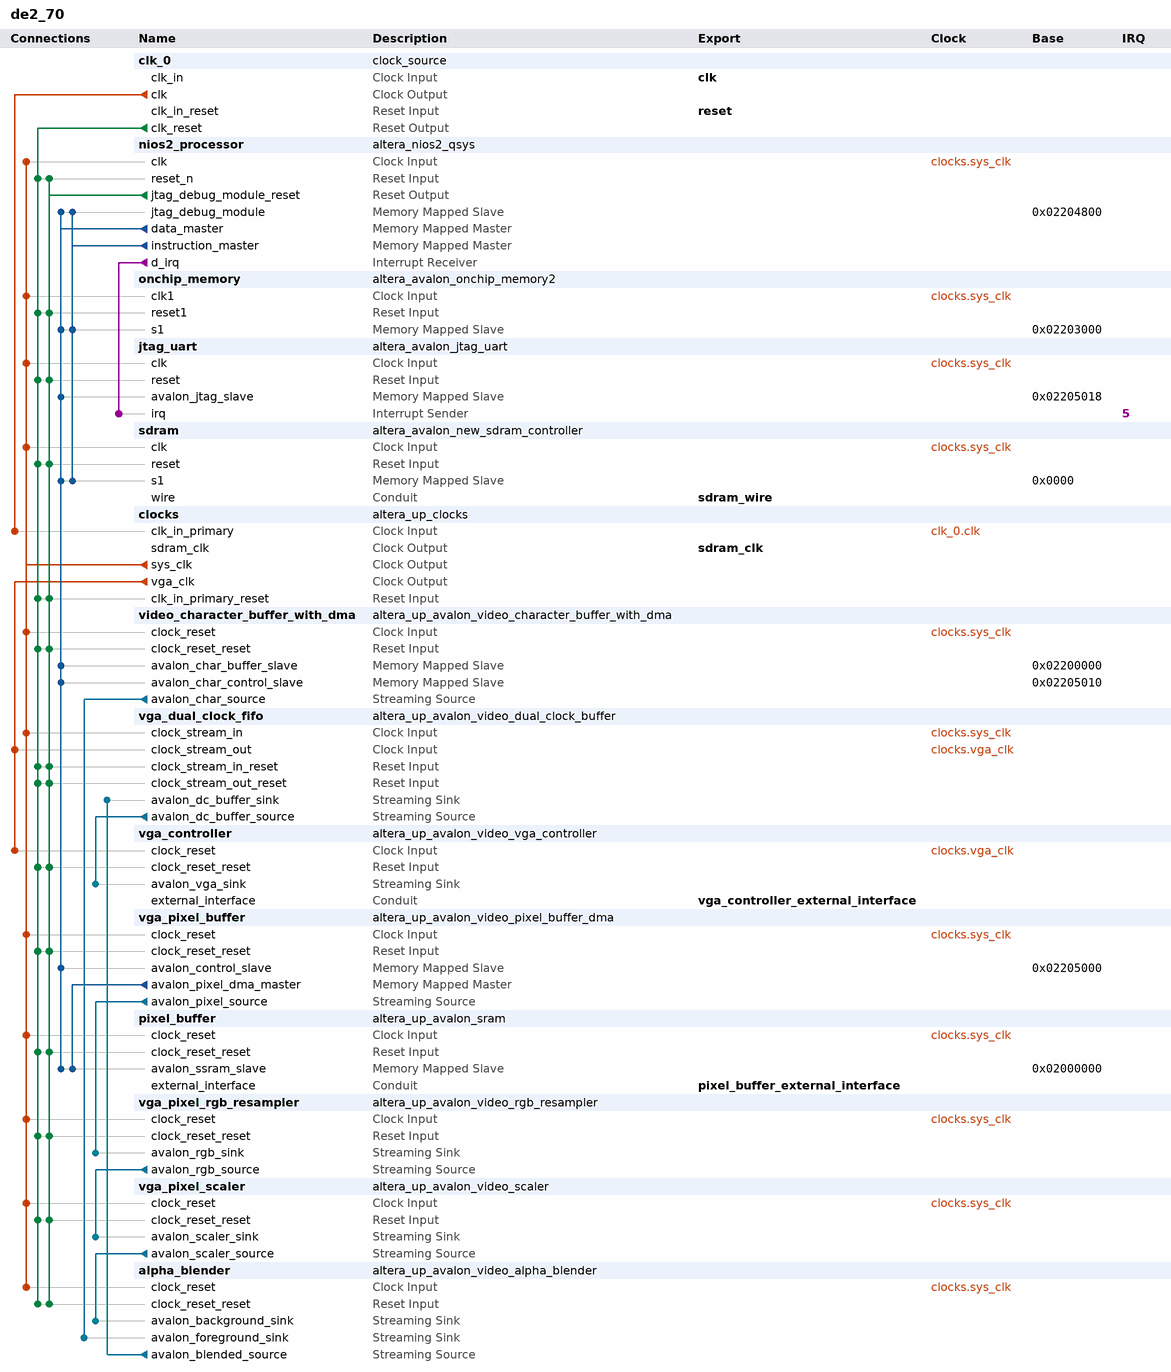
[diagram p0: system contents]
# Platform Designer (Qsys) system de2_70, Cyclone II EP2C70F896C6
# Parameters at their usual value, and those the tool derives, are not listed.
package require -exact qsys 13.0
create_system de2_70
set_project_property DEVICE_FAMILY {Cyclone II}
set_project_property DEVICE EP2C70F896C6

add_instance clk_0 clock_source 13.0
set_instance_parameter_value clk_0 clockFrequency 50000000

add_instance nios2_processor altera_nios2_qsys 13.0
set_instance_parameter_value nios2_processor resetSlave sdram.s1
set_instance_parameter_value nios2_processor mmu_TLBMissExcSlave None
set_instance_parameter_value nios2_processor exceptionSlave sdram.s1
set_instance_parameter_value nios2_processor breakSlave nios2_processor.jtag_debug_module
set_instance_parameter_value nios2_processor impl Tiny
set_instance_parameter_value nios2_processor icache_size 4096

add_instance onchip_memory altera_avalon_onchip_memory2 13.0.1.99.2
set_instance_parameter_value onchip_memory dataWidth 32
set_instance_parameter_value onchip_memory dualPort false
set_instance_parameter_value onchip_memory initMemContent true
set_instance_parameter_value onchip_memory initializationFileName onchip_mem.hex
set_instance_parameter_value onchip_memory memorySize 4096

add_instance jtag_uart altera_avalon_jtag_uart 13.0.1.99.2
set_instance_parameter_value jtag_uart simInteractiveOptions NO_INTERACTIVE_WINDOWS

add_instance sdram altera_avalon_new_sdram_controller 13.0.1.99.2
set_instance_parameter_value sdram TAC 5.5
set_instance_parameter_value sdram TRCD 20.0
set_instance_parameter_value sdram TRP 20.0
set_instance_parameter_value sdram casLatency 3
set_instance_parameter_value sdram columnWidth 9
set_instance_parameter_value sdram dataWidth 16
set_instance_parameter_value sdram generateSimulationModel false
set_instance_parameter_value sdram model single_Micron_MT48LC4M32B2_7_chip
set_instance_parameter_value sdram numberOfBanks 4
set_instance_parameter_value sdram numberOfChipSelects 1
set_instance_parameter_value sdram powerUpDelay 200.0
set_instance_parameter_value sdram refreshPeriod 7.8125
set_instance_parameter_value sdram rowWidth 13

add_instance clocks altera_up_clocks 13.0
set_instance_parameter_value clocks board DE2-70
set_instance_parameter_value clocks vga_clk true
set_instance_parameter_value clocks audio_clk false
set_instance_parameter_value clocks audio_clk_freq 12.288

add_instance video_character_buffer_with_dma altera_up_avalon_video_character_buffer_with_dma 13.0
set_instance_parameter_value video_character_buffer_with_dma enable_transparency true

add_instance vga_dual_clock_fifo altera_up_avalon_video_dual_clock_buffer 13.0
set_instance_parameter_value vga_dual_clock_fifo color_bits 10

add_instance vga_controller altera_up_avalon_video_vga_controller 13.0
set_instance_parameter_value vga_controller board DE2-70

add_instance vga_pixel_buffer altera_up_avalon_video_pixel_buffer_dma 13.0
set_instance_parameter_value vga_pixel_buffer addr_mode X-Y
set_instance_parameter_value vga_pixel_buffer start_address 134217728
set_instance_parameter_value vga_pixel_buffer back_start_address 134217728
set_instance_parameter_value vga_pixel_buffer image_width 320
set_instance_parameter_value vga_pixel_buffer image_height 240
set_instance_parameter_value vga_pixel_buffer color_space {16-bit RGB}

add_instance pixel_buffer altera_up_avalon_sram 13.0
set_instance_parameter_value pixel_buffer board DE2-70
set_instance_parameter_value pixel_buffer pixel_buffer true

add_instance vga_pixel_rgb_resampler altera_up_avalon_video_rgb_resampler 13.0
set_instance_parameter_value vga_pixel_rgb_resampler input_type {16-bit RGB}
set_instance_parameter_value vga_pixel_rgb_resampler output_type {30-bit RGB}
set_instance_parameter_value vga_pixel_rgb_resampler alpha 1023

add_instance vga_pixel_scaler altera_up_avalon_video_scaler 13.0
set_instance_parameter_value vga_pixel_scaler width_scaling 2
set_instance_parameter_value vga_pixel_scaler height_scaling 2
set_instance_parameter_value vga_pixel_scaler width_in 320
set_instance_parameter_value vga_pixel_scaler color_bits 10
set_instance_parameter_value vga_pixel_scaler color_planes 3

add_instance alpha_blender altera_up_avalon_video_alpha_blender 13.0

# connections
add_connection clk_0.clk clocks.clk_in_primary clock
add_connection clocks.sys_clk alpha_blender.clock_reset clock
add_connection clocks.sys_clk jtag_uart.clk clock
add_connection clocks.sys_clk nios2_processor.clk clock
add_connection clocks.sys_clk onchip_memory.clk1 clock
add_connection clocks.sys_clk pixel_buffer.clock_reset clock
add_connection clocks.sys_clk sdram.clk clock
add_connection clocks.sys_clk vga_dual_clock_fifo.clock_stream_in clock
add_connection clocks.sys_clk vga_pixel_buffer.clock_reset clock
add_connection clocks.sys_clk vga_pixel_rgb_resampler.clock_reset clock
add_connection clocks.sys_clk vga_pixel_scaler.clock_reset clock
add_connection clocks.sys_clk video_character_buffer_with_dma.clock_reset clock
add_connection clocks.vga_clk vga_controller.clock_reset clock
add_connection clocks.vga_clk vga_dual_clock_fifo.clock_stream_out clock
add_connection clk_0.clk_reset alpha_blender.clock_reset_reset reset
add_connection clk_0.clk_reset clocks.clk_in_primary_reset reset
add_connection clk_0.clk_reset jtag_uart.reset reset
add_connection clk_0.clk_reset nios2_processor.reset_n reset
add_connection clk_0.clk_reset onchip_memory.reset1 reset
add_connection clk_0.clk_reset pixel_buffer.clock_reset_reset reset
add_connection clk_0.clk_reset sdram.reset reset
add_connection clk_0.clk_reset vga_controller.clock_reset_reset reset
add_connection clk_0.clk_reset vga_dual_clock_fifo.clock_stream_in_reset reset
add_connection clk_0.clk_reset vga_dual_clock_fifo.clock_stream_out_reset reset
add_connection clk_0.clk_reset vga_pixel_buffer.clock_reset_reset reset
add_connection clk_0.clk_reset vga_pixel_rgb_resampler.clock_reset_reset reset
add_connection clk_0.clk_reset vga_pixel_scaler.clock_reset_reset reset
add_connection clk_0.clk_reset video_character_buffer_with_dma.clock_reset_reset reset
add_connection nios2_processor.jtag_debug_module_reset alpha_blender.clock_reset_reset reset
add_connection nios2_processor.jtag_debug_module_reset clocks.clk_in_primary_reset reset
add_connection nios2_processor.jtag_debug_module_reset jtag_uart.reset reset
add_connection nios2_processor.jtag_debug_module_reset nios2_processor.reset_n reset
add_connection nios2_processor.jtag_debug_module_reset onchip_memory.reset1 reset
add_connection nios2_processor.jtag_debug_module_reset pixel_buffer.clock_reset_reset reset
add_connection nios2_processor.jtag_debug_module_reset sdram.reset reset
add_connection nios2_processor.jtag_debug_module_reset vga_controller.clock_reset_reset reset
add_connection nios2_processor.jtag_debug_module_reset vga_dual_clock_fifo.clock_stream_in_reset reset
add_connection nios2_processor.jtag_debug_module_reset vga_dual_clock_fifo.clock_stream_out_reset reset
add_connection nios2_processor.jtag_debug_module_reset vga_pixel_buffer.clock_reset_reset reset
add_connection nios2_processor.jtag_debug_module_reset vga_pixel_rgb_resampler.clock_reset_reset reset
add_connection nios2_processor.jtag_debug_module_reset vga_pixel_scaler.clock_reset_reset reset
add_connection nios2_processor.jtag_debug_module_reset video_character_buffer_with_dma.clock_reset_reset reset
add_connection nios2_processor.data_master jtag_uart.avalon_jtag_slave avalon
set_connection_parameter_value nios2_processor.data_master/jtag_uart.avalon_jtag_slave baseAddress 0x02205018
add_connection nios2_processor.data_master nios2_processor.jtag_debug_module avalon
set_connection_parameter_value nios2_processor.data_master/nios2_processor.jtag_debug_module baseAddress 0x02204800
add_connection nios2_processor.data_master onchip_memory.s1 avalon
set_connection_parameter_value nios2_processor.data_master/onchip_memory.s1 baseAddress 0x02203000
add_connection nios2_processor.data_master pixel_buffer.avalon_ssram_slave avalon
set_connection_parameter_value nios2_processor.data_master/pixel_buffer.avalon_ssram_slave baseAddress 0x02000000
add_connection nios2_processor.data_master sdram.s1 avalon
set_connection_parameter_value nios2_processor.data_master/sdram.s1 baseAddress 0x0000
add_connection nios2_processor.data_master vga_pixel_buffer.avalon_control_slave avalon
set_connection_parameter_value nios2_processor.data_master/vga_pixel_buffer.avalon_control_slave baseAddress 0x02205000
add_connection nios2_processor.data_master video_character_buffer_with_dma.avalon_char_buffer_slave avalon
set_connection_parameter_value nios2_processor.data_master/video_character_buffer_with_dma.avalon_char_buffer_slave baseAddress 0x02200000
add_connection nios2_processor.data_master video_character_buffer_with_dma.avalon_char_control_slave avalon
set_connection_parameter_value nios2_processor.data_master/video_character_buffer_with_dma.avalon_char_control_slave baseAddress 0x02205010
add_connection nios2_processor.instruction_master nios2_processor.jtag_debug_module avalon
set_connection_parameter_value nios2_processor.instruction_master/nios2_processor.jtag_debug_module baseAddress 0x02204800
add_connection nios2_processor.instruction_master onchip_memory.s1 avalon
set_connection_parameter_value nios2_processor.instruction_master/onchip_memory.s1 baseAddress 0x02203000
add_connection nios2_processor.instruction_master sdram.s1 avalon
set_connection_parameter_value nios2_processor.instruction_master/sdram.s1 baseAddress 0x0000
add_connection vga_pixel_buffer.avalon_pixel_dma_master pixel_buffer.avalon_ssram_slave avalon
set_connection_parameter_value vga_pixel_buffer.avalon_pixel_dma_master/pixel_buffer.avalon_ssram_slave baseAddress 0x02000000
add_connection alpha_blender.avalon_blended_source vga_dual_clock_fifo.avalon_dc_buffer_sink avalon_streaming
add_connection vga_dual_clock_fifo.avalon_dc_buffer_source vga_controller.avalon_vga_sink avalon_streaming
add_connection vga_pixel_buffer.avalon_pixel_source vga_pixel_rgb_resampler.avalon_rgb_sink avalon_streaming
add_connection vga_pixel_rgb_resampler.avalon_rgb_source vga_pixel_scaler.avalon_scaler_sink avalon_streaming
add_connection vga_pixel_scaler.avalon_scaler_source alpha_blender.avalon_background_sink avalon_streaming
add_connection video_character_buffer_with_dma.avalon_char_source alpha_blender.avalon_foreground_sink avalon_streaming
add_connection nios2_processor.d_irq jtag_uart.irq interrupt
set_connection_parameter_value nios2_processor.d_irq/jtag_uart.irq irqNumber 5

# exported interfaces
add_interface clk clock sink
set_interface_property clk EXPORT_OF clk_0.clk_in
add_interface reset reset sink
set_interface_property reset EXPORT_OF clk_0.clk_in_reset
add_interface sdram_wire conduit end
set_interface_property sdram_wire EXPORT_OF sdram.wire
add_interface sdram_clk clock source
set_interface_property sdram_clk EXPORT_OF clocks.sdram_clk
add_interface vga_controller_external_interface conduit end
set_interface_property vga_controller_external_interface EXPORT_OF vga_controller.external_interface
add_interface pixel_buffer_external_interface conduit end
set_interface_property pixel_buffer_external_interface EXPORT_OF pixel_buffer.external_interface

set_interconnect_requirement {$system} qsys_mm.clockCrossingAdapter HANDSHAKE
set_interconnect_requirement {$system} qsys_mm.maxAdditionalLatency 1

save_system de2_70.qsys
